# EAGLE schematic laserabluft (EAGLE 6.5.0)
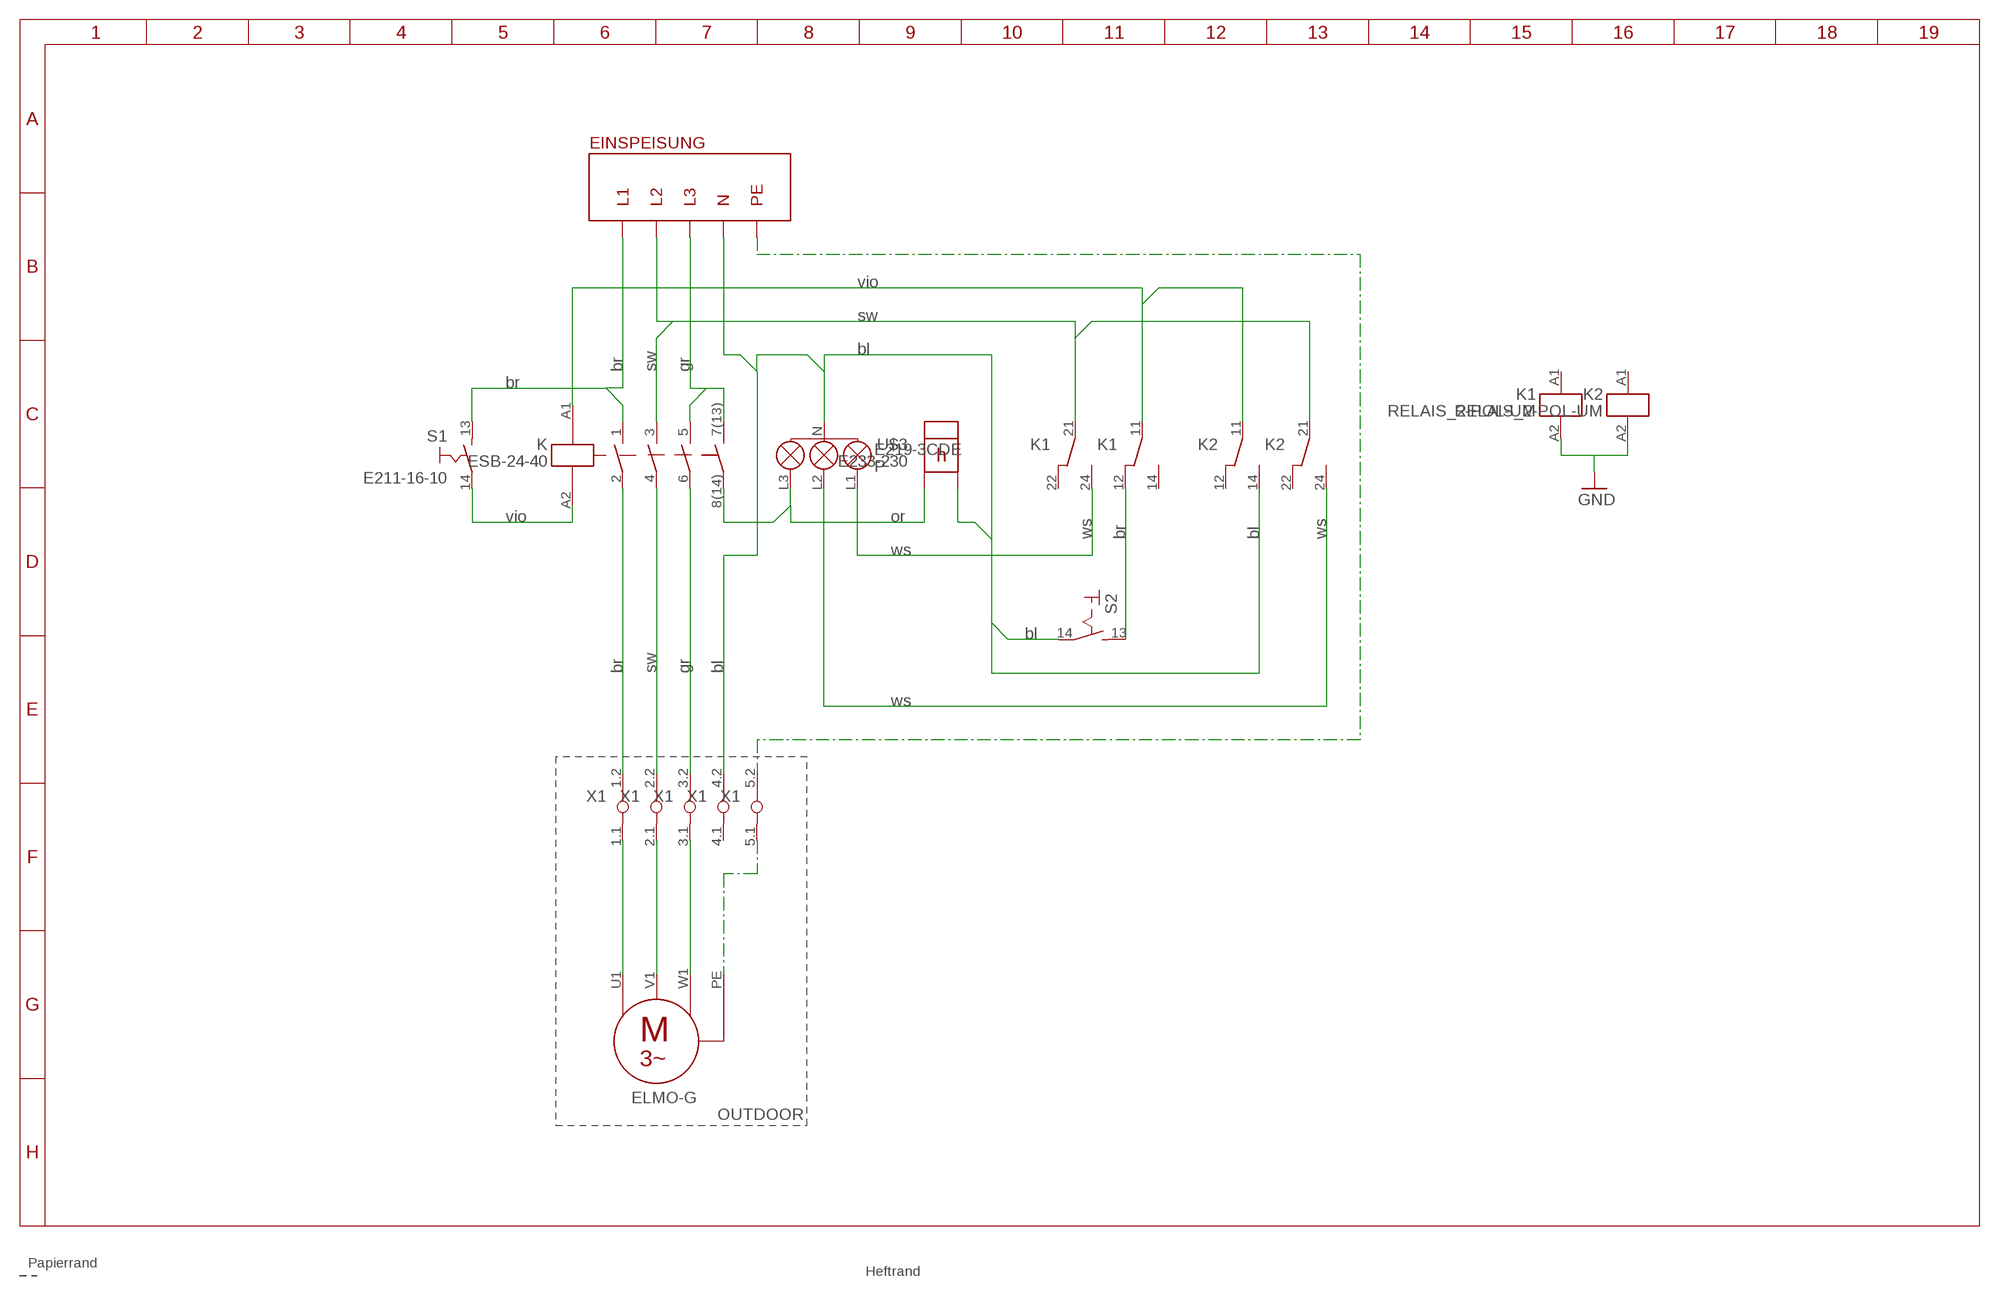
[diagram p0: schematic, sheet 1]

## Parts
ELMO-G  MOTOR_3-POL_PE  [MOTOR_3-POL_PE]
K  ESB-24-40  ESB-40  [ESB_40/63]
K1  RELAIS_2-POL-UM  [RELAIS_2-POL-UM]
K2  RELAIS_2-POL-UM  [RELAIS_2-POL-UM]
P  E219-3CDE  E219-3  [E219-3*]
S1  E211-16-10  SCHLIESSER_RASTSCHALTER  [SCHLIESSER_RASTSCHALTER]
S2  KIPPSCHALTER_AUS  [EINTASTER]
U$3  E233-230  E233-  [E233-*]
X1  KLEMME_1-5  [KLEMME_1-5]

## Nets
GND: K1.A2 K2.A2
L1-EXT: K.1 S1.13
L2-EXT: K1.21 K2.21 K.3
L3-EXT: K.5 K.7(13)
N$1: K.A2 S1.14
N$2: K1.24 P.L1
N$3: K2.24 P.L2
N$4: K1.11 K2.11 K.A1
N$5: K.8(14) P.L3 U$3.P$1
N$6: K1.12 S2.13
N$7: K.6 X1.3.2(3:3.2)
N$8: K.4 X1.2.2(2:2.2)
N$9: K.2 X1.1.2(1:1.2)
N$10: ELMO-G.PE X1.5.1(5:5.1)
N$11: ELMO-G.W1 X1.3.1(3:3.1)
N$12: ELMO-G.V1 X1.2.1(2:2.1)
N$13: ELMO-G.U1 X1.1.1(1:1.1)
N-EXT: K2.14 P.N S2.14 U$3.P$2 X1.4.2(4:4.2)
PE-EXT: X1.5.2(5:5.2)
Unconnected: K1.14 K1.22 K1.A1 K2.12 K2.22 K2.A1 K.21 K.22 K.33 K.34 X1.4.1(4:4.1)

## Notes on the sheet
- vio
- sw
- bl
- br | sw | gr
- br
- vio | or
- ws | br | bl | ws
- ws
- bl
- br | sw | gr | bl
- ws
- OUTDOOR

## Library data of the parts
ELMO-G = e-motoren:MOTOR_3-POL_PE: 3-Phasen-Motor mit PE
K = ABB:ESB*-40
K1 K2 = e-schuetze-relais:RELAIS_2-POL-UM: Relais mit 2 Wechsleschalter
P = ABB:E219-3*
S1 = e-schalter:SCHLIESSER_RASTSCHALTER: Rastschalter, Schließer
S2 = e-schalter:KIPPSCHALTER_AUS: Kippschalter
U$3 = ABB:E233-*
X1 = e-klemmen:KLEMME_1-5: Klemme 5 Pol.